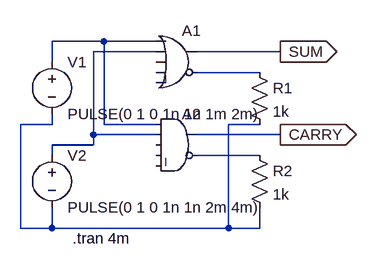
[diagram p0: schematic Half_adder.asc]
Half_adder.asc, the LTspice schematic file:
Version 4
SHEET 1 880 680
WIRE 112 64 32 64
WIRE 192 64 112 64
WIRE 192 80 96 80
WIRE 384 80 256 80
WIRE 32 96 32 64
WIRE 352 112 256 112
WIRE 32 192 32 176
WIRE 32 192 -16 192
WIRE 112 192 112 64
WIRE 192 192 112 192
WIRE 352 192 304 192
WIRE 96 208 96 80
WIRE 192 208 96 208
WIRE 384 208 256 208
WIRE 96 224 96 208
WIRE 96 224 32 224
WIRE 32 240 32 224
WIRE 352 240 256 240
WIRE -16 352 -16 192
WIRE 32 352 32 320
WIRE 32 352 -16 352
WIRE 304 352 304 192
WIRE 304 352 32 352
WIRE 352 352 352 320
WIRE 352 352 304 352
FLAG 384 80 SUM
IOPIN 384 80 Out
FLAG 384 208 CARRY
IOPIN 384 208 Out
SYMBOL voltage 32 80 R0
WINDOW 123 0 0 Left 0
WINDOW 39 0 0 Left 0
SYMATTR InstName V1
SYMATTR Value PULSE(0 1 0 1n 1n 1m 2m)
SYMBOL voltage 32 224 R0
WINDOW 123 0 0 Left 0
WINDOW 39 0 0 Left 0
SYMATTR InstName V2
SYMATTR Value PULSE(0 1 0 1n 1n 2m 4m)
SYMBOL Digital\\or 224 32 R0
SYMATTR InstName A1
SYMBOL Digital\\and 224 160 R0
SYMATTR InstName A2
SYMBOL res 336 96 R0
SYMATTR InstName R1
SYMATTR Value 1k
SYMBOL res 336 224 R0
SYMATTR InstName R2
SYMATTR Value 1k
TEXT 64 368 Left 2 !.tran 4m

The netlist it stands for:
* Half_adder.asc
V1 N001 N004 PULSE(0 1 0 1n 1n 1m 2m)
V2 N002 N004 PULSE(0 1 0 1n 1n 2m 4m)
A1 N001 N002 0 0 0 N003 SUM 0 OR
A2 N001 N002 0 0 0 N005 CARRY 0 AND
R1 N003 N004 1k
R2 N005 N004 1k
.tran 4m
.backanno
.end